# EAGLE schematic hopperBoardV2 (EAGLE 9.5.0)
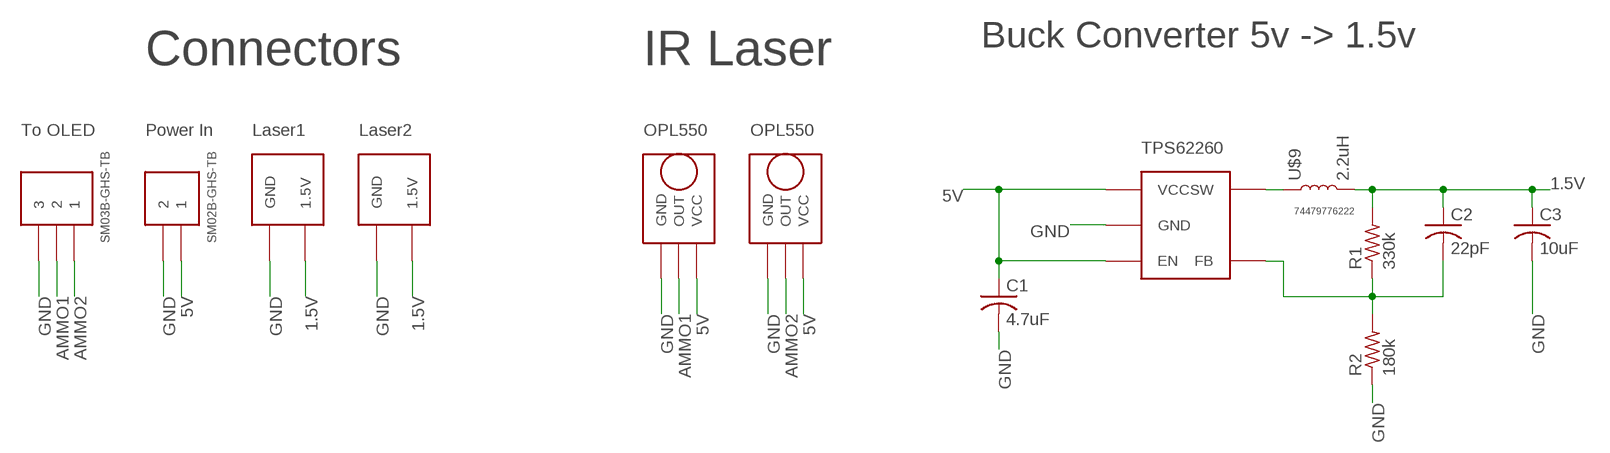
[diagram p0: schematic, sheet 1]

## Parts
C1  4.7uF  C-USC0603  [C0603]
C2  22pF  C-USC0603  [C0603]
C3  10uF  C-USC0603  [C0603]
R1  330k  R-US_R0603  [R0603]
R2  180k  R-US_R0603  [R0603]
U$1  2PIN  [2PIN]
U$2  2PIN  [2PIN]
U$3  OPL550  [OPL550]
U$4  OPL550  [OPL550]
U$5  TPS62260  [TPS62260]
U$6  SM02B-GHS-TB  [SM02B-GHS-TB]
U$8  SM03B-GHS-TB  [SM03B-GHS-TB]
U$9  2.2uH  74479776222  [74479776222]

## Nets
1.5V: C2.1 C3.1 R1.2 U$1.P$2(1.5V) U$2.P$2(1.5V) U$9.P$2
5V: C1.1 U$3.P$3(VCC) U$4.P$3(VCC) U$5.P$1(VCC) U$5.P$3(EN) U$6.P$3
AMMO1: U$3.P$2(OUT) U$8.P$4
AMMO2: U$4.P$2(OUT) U$8.P$3
GND: C1.2 C3.2 R2.1 U$1.P$1(GND) U$2.P$1(GND) U$3.P$1(GND) U$4.P$1(GND) U$5.P$2(GND) U$6.P$4 U$8.P$5
N$1: U$5.P$5(SW) U$9.P$1
N$4: C2.2 R1.1 R2.2 U$5.P$4(FB)

## Notes on the sheet
- Buck Converter 5v -> 1.5v
- Connectors | IR Laser
- To OLED | Power In | Laser1 | Laser2

## Library data of the parts
C1-C3 = rcl:C-US: CAPACITOR, American symbol; SPICEPREFIX: C
R1 R2 = rcl:R-US_: RESISTOR, American symbol; SPICEPREFIX: R
U$1 U$2 = _HenrySilva:2PIN
U$3 U$4 = _HenrySilva:OPL550
U$5 = _HenrySilva:TPS62260
U$6 = _HenrySilva:SM02B-GHS-TB
U$8 = _HenrySilva:SM03B-GHS-TB
U$9 = _HenrySilva:74479776222